# Altium project OpenMV.PrjPcb
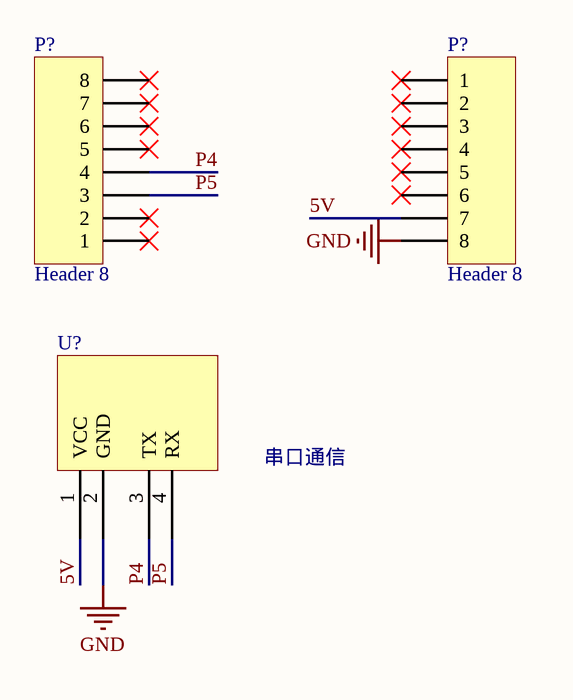
[diagram p0: openmv-Layout.SchDoc]
1 sheet, 3 parts. Net scope: global (net labels, ports and power ports of the same name join across sheets).
Board file: opemv.PcbDoc

## Sheet openmv-Layout.SchDoc
size Legal

### Parts
P1  Header 8  [HDR1X8]
P2  Header 8  [HDR1X8]
U1  串口通信  [J-XH-4AW短]

### Nets
GND: P2.8 U1.2(GND)
5V: P2.7 U1.1(VCC)
P4: P1.4 U1.3(TX)
P5: P1.3 U1.4(RX)

Not connected (* = marked no-connect by the designer): P1 1* 2* 5* 6* 7* 8*; P2 1* 2* 3* 4* 5* 6*

### Library data of the parts
P1 P2 = Header 8: Header, 8-Pin; LatestRevisionDate: 17-Jul-2002; LatestRevisionNote: Re-released for DXP Platform.; Publisher: Altium Limited
U1 = XH2.54插座-4P